# Altium schematic sheet ESP8685H4.SchDoc
size A4; SheetNumber: 2; SheetTotal: 7; SheetSize: A4; DrawingNumber: SCH-001
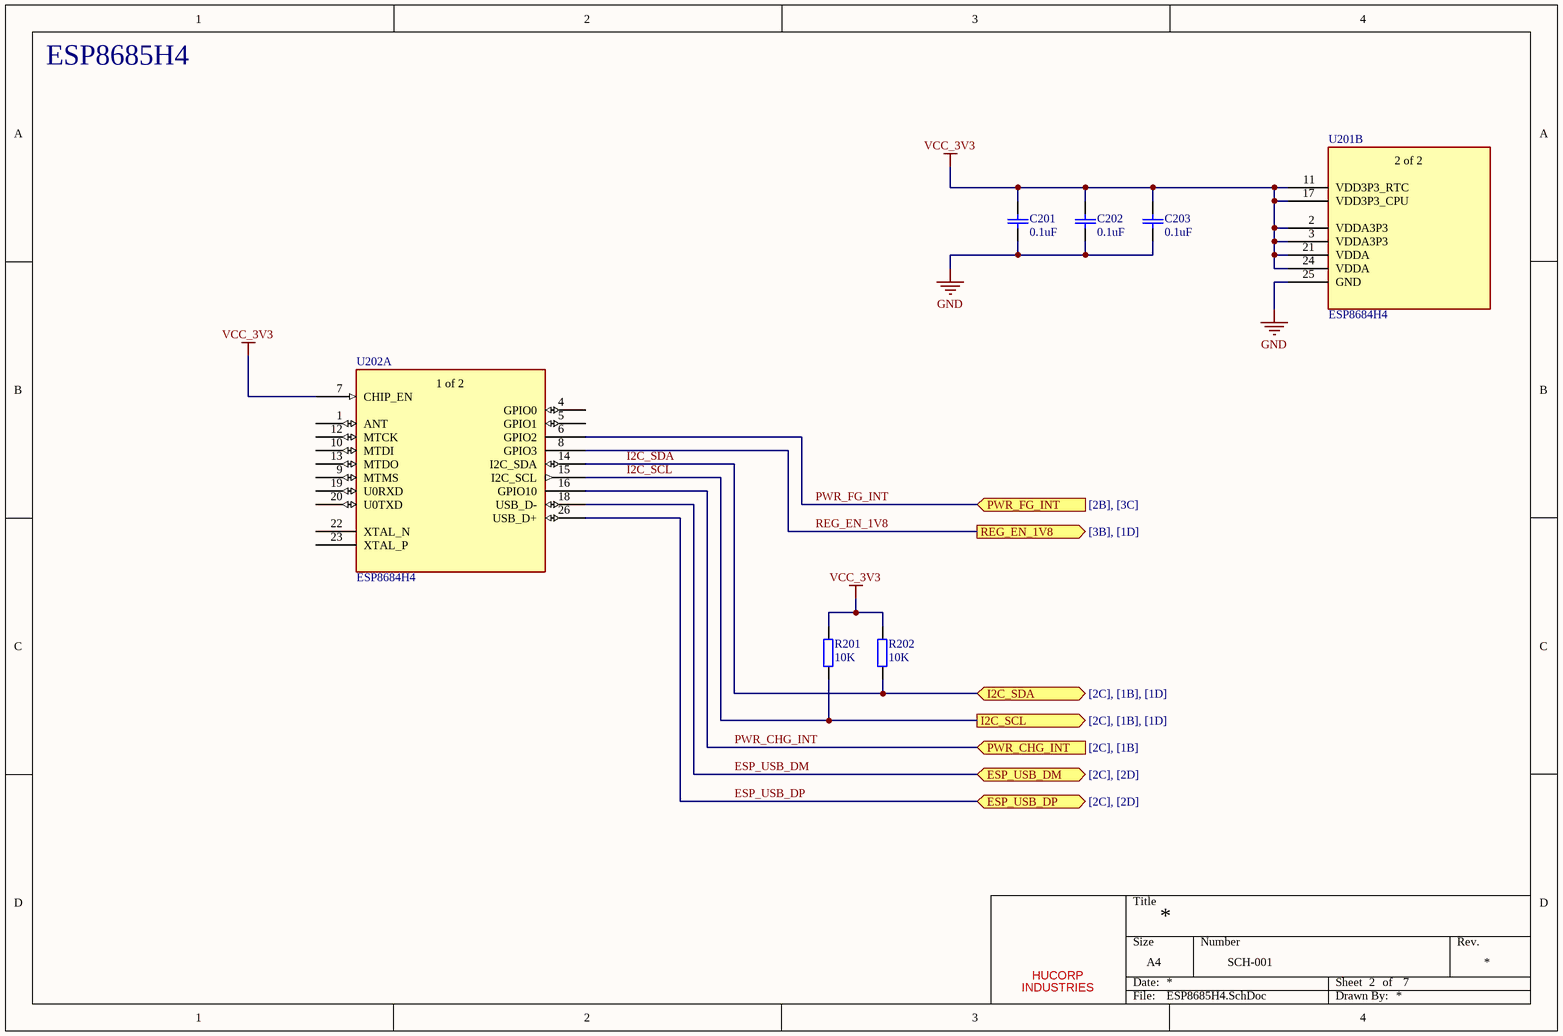
[diagram p0: ESP8685H4.SchDoc]

## Parts
*  HUCORP  (value not drawn)  (graphical)
C201  value 0.1uF  [CAP_CL10_SAM]  (hidden comment: 100 nF)
C202  value 0.1uF  [CAP_CL10_SAM]  (hidden comment: 100 nF)
C203  value 0.1uF  [CAP_CL10_SAM]  (hidden comment: 100 nF)
R201  10K  [RES_RC0603_YAG]
R202  10K  [RES_RC0603_YAG]
U201  ESP8684H4  [QFN24_4X4_EXP]  (part B of 2)
U202  ESP8684H4  [QFN24_4X4_EXP]  (part A of 2)

## Ports
ESP_USB_DM (bidir, see [2C], [2D]), ESP_USB_DP (bidir, see [2C], [2D]), I2C_SCL (out, see [2C], [1B], [1D]), I2C_SDA (bidir, see [2C], [1B], [1D]), PWR_CHG_INT (in, see [2C], [1B]), PWR_FG_INT (in, see [2B], [3C]), REG_EN_1V8 (out, see [3B], [1D])

## Nets
GND: C201.1 C202.1 C203.1 U201.25(GND)
VCC_3V3: C201.2 C202.2 C203.2 R201.2 R202.2 U201.2(VDDA3P3) U201.3(VDDA3P3) U201.11(VDD3P3_RTC) U201.17(VDD3P3_CPU) U201.21(VDDA) U201.24(VDDA) U202.7(CHIP_EN)
ESP_USB_DM: U202.18(USB_D-) ; port ESP_USB_DM
ESP_USB_DP: U202.26(USB_D+) ; port ESP_USB_DP
I2C_SCL: R201.1 U202.15(I2C_SCL) ; port I2C_SCL
I2C_SDA: R202.1 U202.14(I2C_SDA) ; port I2C_SDA
PWR_CHG_INT: U202.16(GPIO10) ; port PWR_CHG_INT
PWR_FG_INT: U202.6(GPIO2) ; port PWR_FG_INT
REG_EN_1V8: U202.8(GPIO3) ; port REG_EN_1V8

Not connected (* = marked no-connect by the designer): U202 1(ANT) 4(GPIO0) 5(GPIO1) 9(MTMS) 10(MTDI) 12(MTCK) 13(MTDO) 19(U0RXD) 20(U0TXD) 22(XTAL_N) 23(XTAL_P)

## Notes on the sheet
- ESP8685H4
- (in symbol ESP8684H4, part A) 1 of 2
- (in symbol ESP8684H4, part B) 2 of 2
- (in symbol TitleBlock1) Title; Size; Number; Rev.; INDUSTRIES; Date:; Sheet; of; File:; Drawn By:

## Library data of the parts
* = TitleBlock1: HUCORP Title Block
C201-C203 = CL10B104KA8NNNC: CAP CER 0.1UF 25V X7R 0603; Mfr_Name: Samsung; Type: DEV; Copyright: Copyright (C) 2022 Ultra Librarian. All rights reserved.; Manufacturer_Part_Number: CL10B104KA8NNNC; Digi-Key_Part_Number_1: 1276-1006-2-ND; Digi-Key_Part_Number_2: 1276-1006-1-ND; Digi-Key_Part_Number_3: 1276-1006-6-ND; RefDes: RefDes
R201 R202 = RC0603JR-1310KL: RES 10K OHM 5% 1/10W 0603; Mfr_Name: Yageo; Copyright: Copyright (C) 2022 Ultra Librarian. All rights reserved.; Manufacturer_Part_Number: RC0603JR-1310KL; Digi-Key_Part_Number_1: 13-RC0603JR-1310KLTR-ND; Digi-Key_Part_Number_2: 13-RC0603JR-1310KLCT-ND; Digi-Key_Part_Number_3: 13-RC0603JR-1310KLDKR-ND; RefDes: RefDes; Type: DEV; Value: 10K
U201 U202 = ESP8684H4: IC RF TxRx + MCU Bluetooth, WiFi 802.11b/g/n, Bluetooth v5.0 2.4GHz 28-VFQFN Exposed Pad; Mfr_Name: Espressif Systems; Manufacturer_Part_Number: ESP8684H2; Copyright: Copyright (C) 2023 Ultra Librarian. All rights reserved.; RefDes: RefDes; Type: DEV